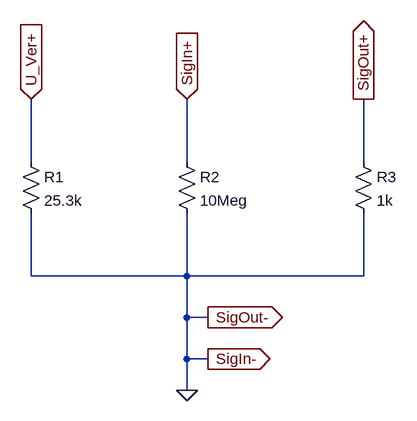
[diagram p0: schematic RNetzwerk_1.asc]
RNetzwerk_1.asc, the LTspice schematic file:
Version 4
SHEET 1 880 680
WIRE -32 -16 -32 -112
WIRE 208 -16 208 -112
WIRE 480 -16 480 -112
WIRE -32 160 -32 64
WIRE 208 160 208 64
WIRE 208 160 -32 160
WIRE 480 160 480 64
WIRE 480 160 208 160
WIRE 208 224 208 160
WIRE 240 224 208 224
WIRE 208 288 208 224
WIRE 240 288 208 288
WIRE 208 336 208 288
FLAG 208 336 0
FLAG -32 -112 U_Ver+
IOPIN -32 -112 In
FLAG 208 -112 SigIn+
IOPIN 208 -112 In
FLAG 480 -112 SigOut+
IOPIN 480 -112 Out
FLAG 240 224 SigOut-
IOPIN 240 224 Out
FLAG 240 288 SigIn-
IOPIN 240 288 Out
SYMBOL res -48 -32 R0
SYMATTR InstName R1
SYMATTR Value 25.3k
SYMBOL res 192 -32 R0
SYMATTR InstName R2
SYMATTR Value 10Meg
SYMBOL res 464 -32 R0
SYMATTR InstName R3
SYMATTR Value 1k

The netlist it stands for:
* RNetzwerk_1.asc
R1 U_Ver+ 0 25.3k
R2 SigIn+ 0 10Meg
R3 SigOut+ 0 1k
.backanno
.end